# Altium schematic sheet MOSFETs and Driver.SchDoc
size Letter; DocumentNumber: 5; SheetNumber: 5; SheetTotal: 8
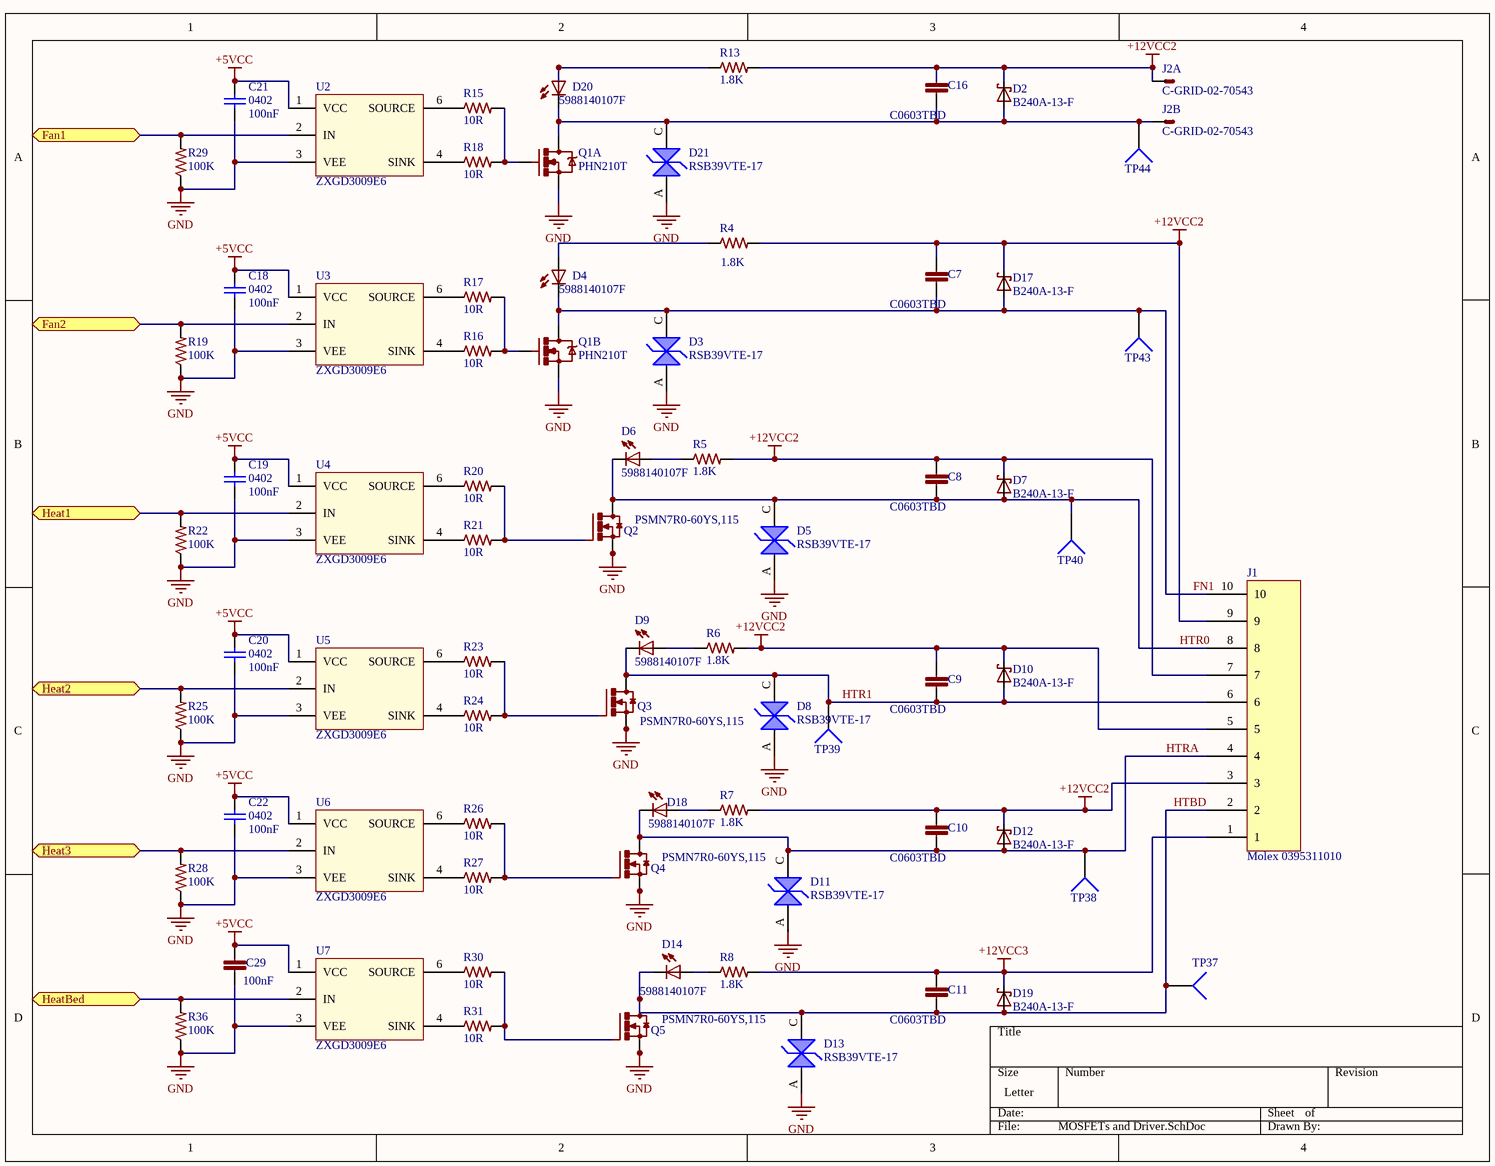
[diagram p0: MOSFETs and Driver.SchDoc]

## Parts
C7  C0603TBD  [C0603]
C8  C0603TBD  [C0603]
C9  C0603TBD  [C0603]
C10  C0603TBD  [C0603]
C11  C0603TBD  [C0603]
C16  C0603TBD  [C0603]
C18  value 100nF  [C0402]  (hidden comment: 0402)
C19  value 100nF  [C0402]  (hidden comment: 0402)
C20  value 100nF  [C0402]  (hidden comment: 0402)
C21  value 100nF  [C0402]  (hidden comment: 0402)
C22  value 100nF  [C0402]  (hidden comment: 0402)
C29  100nF  [C0402]
D2  B240A-13-F  [SMA-SM]
D3  RSB39VTE-17  [SOD323-R]
D4  5988140107F  [LED2012120]
D5  RSB39VTE-17  [SOD323-R]
D6  5988140107F  [LED2012120]
D7  B240A-13-F  [SMA-SM]
D8  RSB39VTE-17  [SOD323-R]
D9  5988140107F  [LED2012120]
D10  B240A-13-F  [SMA-SM]
D11  RSB39VTE-17  [SOD323-R]
D12  B240A-13-F  [SMA-SM]
D13  RSB39VTE-17  [SOD323-R]
D14  5988140107F  [LED2012120]
D17  B240A-13-F  [SMA-SM]
D18  5988140107F  [LED2012120]
D19  B240A-13-F  [SMA-SM]
D20  5988140107F  [LED2012120]
D21  RSB39VTE-17  [SOD323-R]
J1  Molex 0395311010  [MSTBV10]
J2  C-GRID-02-70543  [70543-02]  (parts A,B of 2)
Q1  PHN210T  [SOIC8-dual-drain]  (parts A,B of 2)
Q2  PSMN7R0-60YS,115  [SOT669]
Q3  PSMN7R0-60YS,115  [SOT669]
Q4  PSMN7R0-60YS,115  [SOT669]
Q5  PSMN7R0-60YS,115  [SOT669]
R4  1.8K  [R0603]
R5  1.8K  [R0603]
R6  1.8K  [R0603]
R7  1.8K  [R0603]
R8  1.8K  [R0603]
R13  1.8K  [R0603]
R15  10R  [R0402]
R16  10R  [R0402]
R17  10R  [R0402]
R18  10R  [R0402]
R19  100K  [R0402]
R20  10R  [R0402]
R21  10R  [R0402]
R22  100K  [R0402]
R23  10R  [R0402]
R24  10R  [R0402]
R25  100K  [R0402]
R26  10R  [R0402]
R27  10R  [R0402]
R28  100K  [R0402]
R29  100K  [R0402]
R30  10R  [R0402]
R31  10R  [R0402]
R36  100K  [R0402]
TP37  TP4  [TP-2]  (value not drawn)
TP38  TP4  [TP-2]  (value not drawn)
TP39  TP4  [TP-2]  (value not drawn)
TP40  TP4  [TP-2]  (value not drawn)
TP43  TP4  [TP-2]  (value not drawn)
TP44  TP4  [TP-2]  (value not drawn)
U2  ZXGD3009E6  [SOT26P285X140-6L]
U3  ZXGD3009E6  [SOT26P285X140-6L]
U4  ZXGD3009E6  [SOT26P285X140-6L]
U5  ZXGD3009E6  [SOT26P285X140-6L]
U6  ZXGD3009E6  [SOT26P285X140-6L]
U7  ZXGD3009E6  [SOT26P285X140-6L]

## Ports
Fan1, Fan2, Heat1, Heat2, Heat3, HeatBed

## Nets
+5VCC: C18.2 C19.2 C20.2 C21.2 C22.2 C29.1 U2.1(VCC) U3.1(VCC) U4.1(VCC) U5.1(VCC) U6.1(VCC) U7.1(VCC)
+12VCC2: C7.1 C8.1 C9.1 C10.1 C16.1 D2.C D7.C D10.C D12.C D17.C J1.3 J1.5 J1.7 J1.9 J2.1(S) R4.2 R5.2 R6.2 R7.2 R13.2
+12VCC3: C11.1 D19.C J1.1 R8.2
GND: C18.1 C19.1 C20.1 C21.1 C22.1 C29.2 D3.A D5.A D8.A D11.A D13.A D21.A Q1.1(S) Q1.3(S) Q2.1(S) Q2.2(S) Q2.3(S) Q3.1(S) Q3.2(S) Q3.3(S) Q4.1(S) Q4.2(S) Q4.3(S) Q5.1(S) Q5.2(S) Q5.3(S) R19.1 R22.1 R25.1 R28.1 R29.1 R36.1 U2.3(VEE) U3.3(VEE) U4.3(VEE) U5.3(VEE) U6.3(VEE) U7.3(VEE)
Fan1: R29.2 U2.2(IN) ; port Fan1
Fan2: R19.2 U3.2(IN) ; port Fan2
FN1: C7.2 D3.C D4.C D17.A J1.10 Q1.5(D) TP43.1
Heat1: R22.2 U4.2(IN) ; port Heat1
Heat2: R25.2 U5.2(IN) ; port Heat2
Heat3: R28.2 U6.2(IN) ; port Heat3
HeatBed: R36.2 U7.2(IN) ; port HeatBed
HTBD: C11.2 D13.C D14.C D19.A J1.2 Q5.MB(D) TP37.1
HTR0: C8.2 D5.C D6.C D7.A J1.8 Q2.MB(D) TP40.1
HTR1: C9.2 D8.C D9.C D10.A J1.6 Q3.MB(D) TP39.1
HTRA: C10.2 D11.C D12.A D18.C J1.4 Q4.MB(D) TP38.1
NetC16_2: C16.2 D2.A D20.C D21.C J2.2(S) Q1.7(D) TP44.1
NetD4_A: D4.A R4.1
NetD6_A: D6.A R5.1
NetD9_A: D9.A R6.1
NetD14_A: D14.A R8.1
NetD18_A: D18.A R7.1
NetD20_A: D20.A R13.1
NetQ1_2: Q1.2(G) R15.2 R18.2
NetQ1_4: Q1.4(G) R16.2 R17.2
NetQ2_4: Q2.4(G) R20.2 R21.2
NetQ3_4: Q3.4(G) R23.2 R24.2
NetQ4_4: Q4.4(G) R26.2 R27.2
NetQ5_4: Q5.4(G) R30.2 R31.2
NetR15_1: R15.1 U2.6(SOURCE)
NetR16_1: R16.1 U3.4(SINK)
NetR17_1: R17.1 U3.6(SOURCE)
NetR18_1: R18.1 U2.4(SINK)
NetR20_1: R20.1 U4.6(SOURCE)
NetR21_1: R21.1 U4.4(SINK)
NetR23_1: R23.1 U5.6(SOURCE)
NetR24_1: R24.1 U5.4(SINK)
NetR26_1: R26.1 U6.6(SOURCE)
NetR27_1: R27.1 U6.4(SINK)
NetR30_1: R30.1 U7.6(SOURCE)
NetR31_1: R31.1 U7.4(SINK)

## Library data of the parts
C7-C11 C16 = C0603TBD: Capacitor Non Polarized; LastRevisionNote: ImportComponents; Published: 23-Apr-2014; Publisher: UltiMachine; LastRevisionDate: 23-Apr-2014; VALUE: C0603TBD
C18-C22 = GRM155R71C104KA88D: CAP CER 0.1UF (100nF) 16V 10% X7R 0402; MFR: Murata; Part Description: CAP CER 0.1UF 16V 10% X7R 0402; Published: 10 - Dec - 2014; LatestRevisionDate: 10 - Dec - 2014; LatestRevisionNote: Ultimachine Footprint Added; Publisher: Ultimachine; Component Type: Chip Capacitor; MFR Part #: GRM155R71C104KA88D; Mounting Type: SMT 0402; Datasheet: http://psearch.murata.com/capacitor/product/GRM155R71C104KA88%23.pdf; Height: 0.5 ±0.05mm; Tolerance: 10%; Voltage: 16v; PackageReference: 0402
C29 = GRM155R71C104KA88D: CAP CER 0402 100nF 16V 10% X7R; LastRevisionNote: ImportComponents; Published: 23-Apr-2014; Publisher: UltiMachine; LastRevisionDate: 23-Apr-2014; ManufacturerPartNumber: GRM155R71C104KA88D; VALUE: 100nF
D2 D7 D10 D12 D17 D19 = SK310A: DIODE Schottky 3A SMA; LastRevisionNote: ImportComponents; Published: 23-Apr-2014; Publisher: UltiMachine; LastRevisionDate: 23-Apr-2014; ManufacturerPartNumber: SK310A
D3 D5 D8 D11 D13 D21 = RSB39VTE-17: DIODE TVS
D4 D6 D9 D14 D18 D20 = 5988140107F: LED 0805 Yellow; LastRevisionNote: ImportComponents; Published: 23-Apr-2014; Publisher: UltiMachine; LastRevisionDate: 23-Apr-2014; VALUE: 5988140107F
J1 = 0395311010 - Molex 10 Position Connector: MSBTV10 10 port connector same as RAMBo; Manufacture: Molex; Mounting Type: Through Hole; Part Number: 0395311010; Datasheet: http://www.molex.com/pdm_docs/sd/395311002_sd.pdf; Status: Active; Pin Count: 10 , 5.08mm pitch; Height: *; Lead Free: YES; Cost: 2.46000
J2 = C-GRID-02-70543: Connector 2pos; LastRevisionNote: ImportComponents; Published: 23-Apr-2014; Publisher: UltiMachine; LastRevisionDate: 23-Apr-2014
Q1 = PHN210T: Dual N-channel TrenchMOS intermediate level FET
Q2-Q5 = PSMN7R0-60YS,115: Mosfet N-channel 60V 356A 117W 9.3mOhms; LastRevisionNote: ImportComponents; Published: 23-Apr-2014; Publisher: UltiMachine; LastRevisionDate: 23-Apr-2014; ManufacturerPartNumber: PSMN7R0-60YS,115
R4-R8 R13 = RC0603JR-071K8L: RES 0603 1.8K 100mW 5%; LastRevisionNote: ImportComponents; Published: 23-Apr-2014; Publisher: UltiMachine; LastRevisionDate: 23-Apr-2014; ManufacturerPartNumber: RC0603JR-071K8L; VALUE: 1.8K
R15-R18 R20 R21 R23 R24 R26 R27 R30 R31 = RC0402FR-0710RL: RES SMD 10K OHM 1% 1/16W 0402; ManufacturerPartNumber: RC0402FR-0710KP; LastRevisionNote: ImportComponents; Published: 23-Apr-2014; Publisher: UltiMachine; LastRevisionDate: 23-Apr-2014; VALUE: 10R
R19 R22 R25 R28 R29 R36 = RC1005F104CS: RES SMD 100K OHM 1% 1/16W 0402; Manufacturer: Samsung; LastRevisionNote: ImportComponents; Digilkey #: 1276-3432-1-ND; Published: 23-Apr-2014; Publisher: UltiMachine; LastRevisionDate: 23-Apr-2014; ManufacturerPartNumber: RC1005F104CS; VALUE: 100K
TP37-TP40 TP43 TP44 = Socket: LatestRevisionDate: 17-Jul-2002; LatestRevisionNote: Re-released for DXP Platform.; Publisher: Altium Limited
U2-U7 = ZXGD3009E6: MOSFET DRVR 3A 1-OUT High Speed Non-Inv6-Pin SOT-26 T/R